# Altium schematic sheet Switch Network.SchDoc
size B; Organization: MASA; SheetNumber: 3; SheetTotal: 7
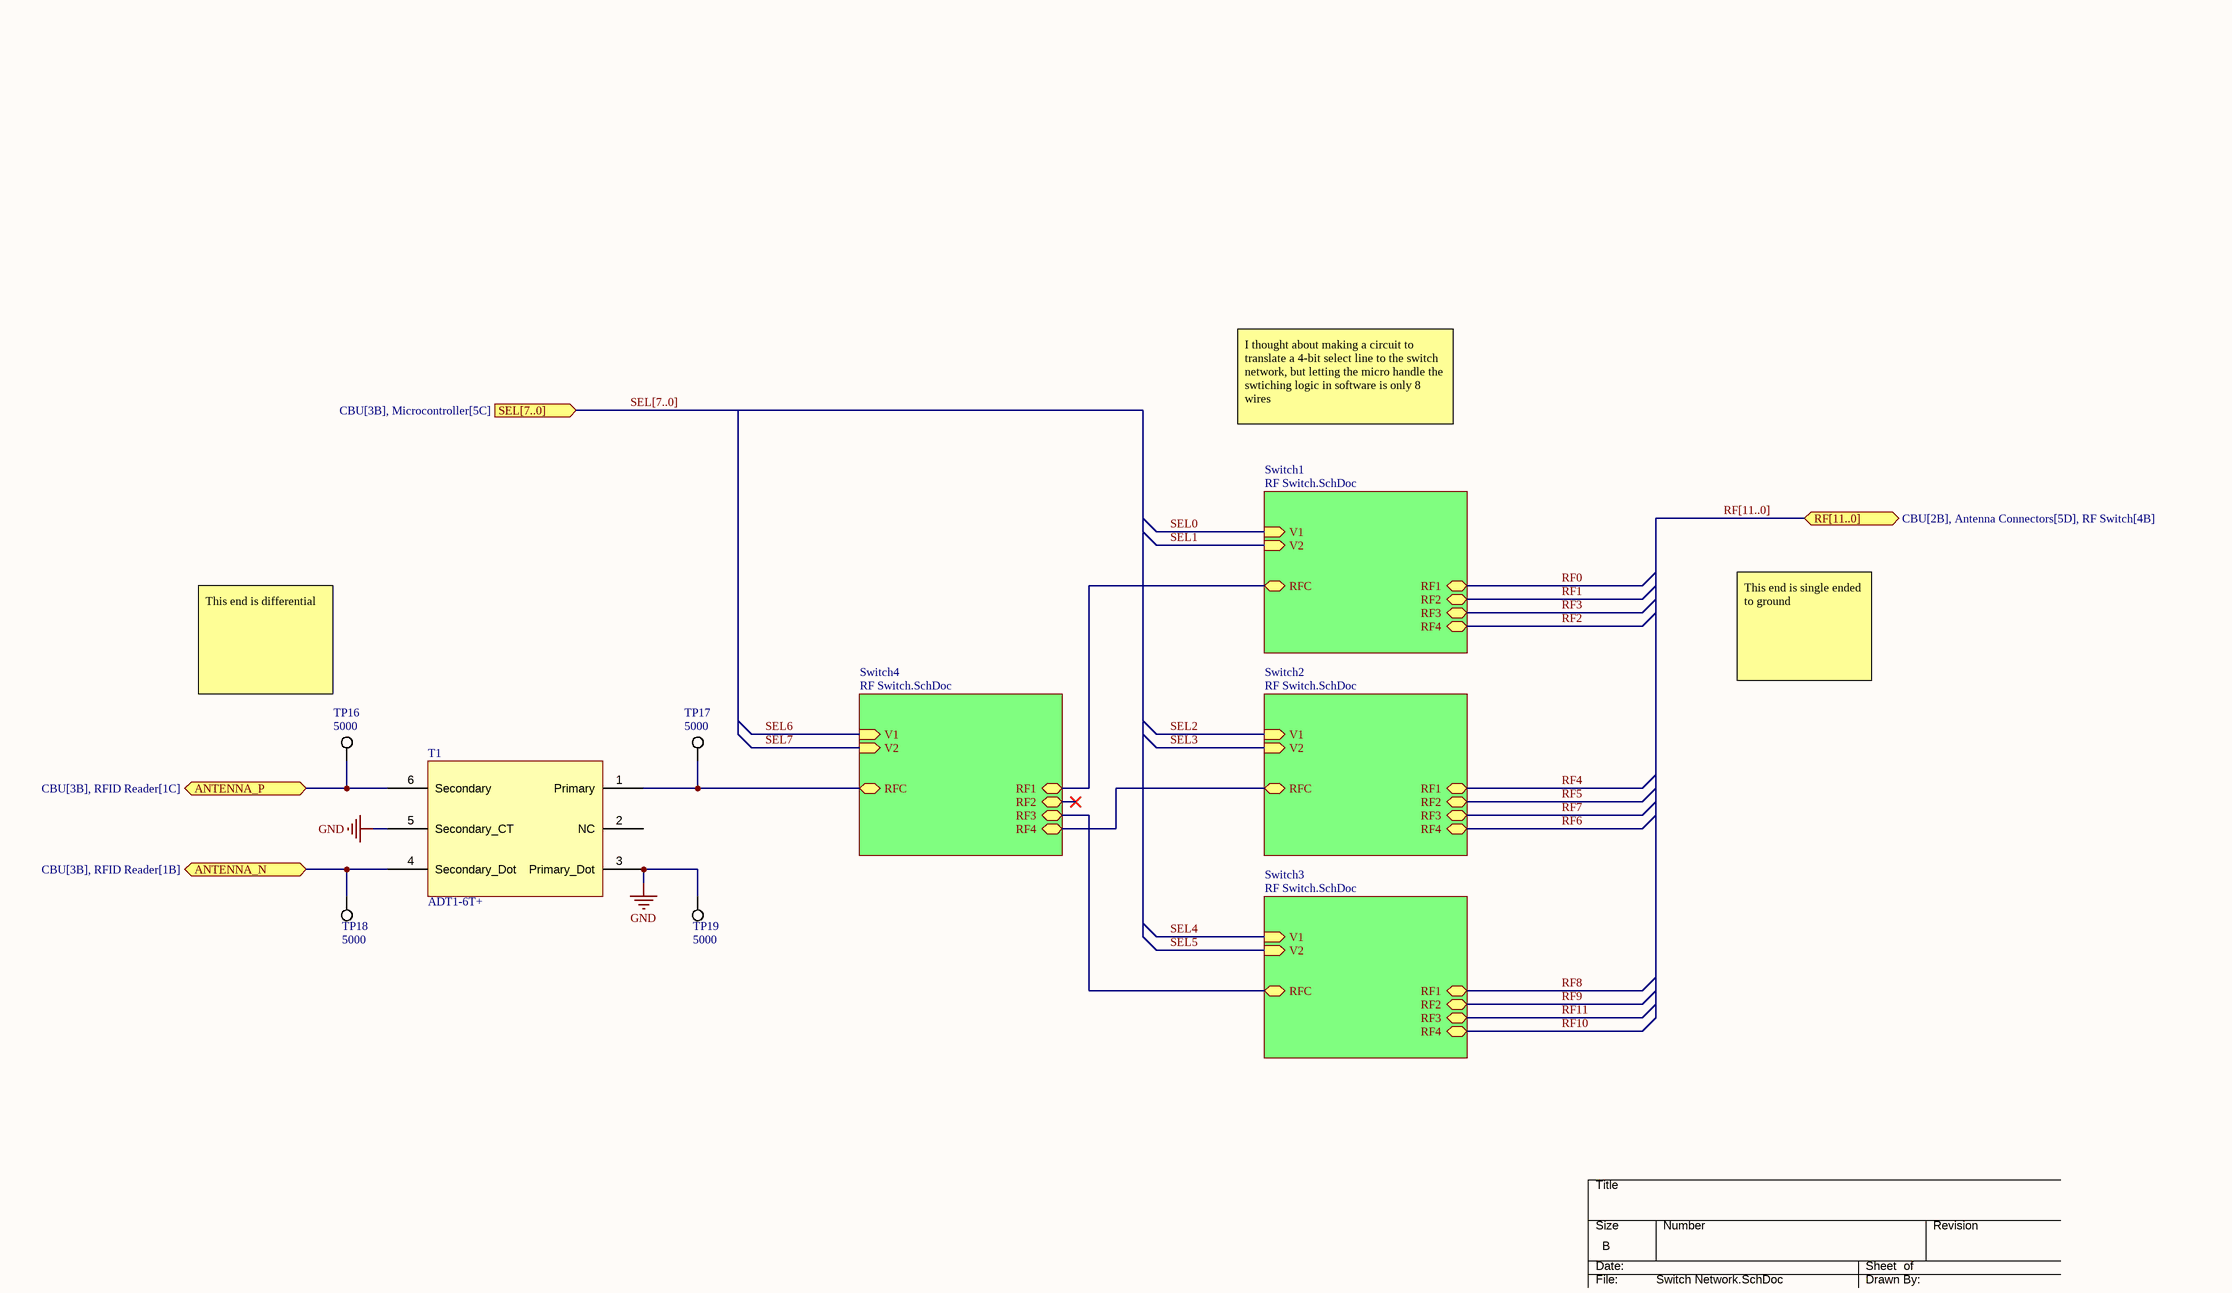
[diagram p0: Switch Network.SchDoc]

## Parts
T1  ADT1-6T+  [ADT1-6T+]
TP16  5000  [FP-5000-MFG]
TP17  5000  [FP-5000-MFG]
TP18  5000  [FP-5000-MFG]
TP19  5000  [FP-5000-MFG]

## Sub-sheets
Switch1 = RF Switch.SchDoc: V1 (in), V2 (in), RF1 (bidir), RF2 (bidir), RF3 (bidir), RF4 (bidir), RFC (bidir)
Switch2 = RF Switch.SchDoc: V1 (in), V2 (in), RF1 (bidir), RF2 (bidir), RF3 (bidir), RF4 (bidir), RFC (bidir)
Switch3 = RF Switch.SchDoc: V1 (in), V2 (in), RF1 (bidir), RF2 (bidir), RF3 (bidir), RF4 (bidir), RFC (bidir)
Switch4 = RF Switch.SchDoc: V1 (in), V2 (in), RF1 (bidir), RF2 (bidir), RF3 (bidir), RF4 (bidir), RFC (bidir)

## Ports
ANTENNA_N (bidir, see CBU[3B], RFID Reader[1B]), ANTENNA_P (bidir, see CBU[3B], RFID Reader[1C]), RF[11..0] (bidir, see CBU[2B], Antenna Connectors[5D], RF Switch[4B]), SEL[7..0] (in, see CBU[3B], Microcontroller[5C])

## Nets
GND: T1.3(Primary_Dot) T1.5(Secondary_CT) TP19.1
ANTENNA_N: T1.4(Secondary_Dot) TP18.1 ; port ANTENNA_N
ANTENNA_P: T1.6(Secondary) TP16.1 ; port ANTENNA_P
RF0: sheet Switch1/RF1
RF1: sheet Switch1/RF2
RF2: sheet Switch1/RF4
RF3: sheet Switch1/RF3
RF4: sheet Switch2/RF1
RF5: sheet Switch2/RF2
RF6: sheet Switch2/RF4
RF7: sheet Switch2/RF3
RF8: sheet Switch3/RF1
RF9: sheet Switch3/RF2
RF10: sheet Switch3/RF4
RF11: sheet Switch3/RF3
SEL0: sheet Switch1/V1
SEL1: sheet Switch1/V2
SEL2: sheet Switch2/V1
SEL3: sheet Switch2/V2
SEL4: sheet Switch3/V1
SEL5: sheet Switch3/V2
SEL6: sheet Switch4/V1
SEL7: sheet Switch4/V2
NetT1_1: T1.1(Primary) TP17.1 ; sheet Switch4/RFC
(unnamed): sheet Switch1/RFC, sheet Switch4/RF1
(unnamed): sheet Switch2/RFC, sheet Switch4/RF4
(unnamed): sheet Switch3/RFC, sheet Switch4/RF3

Not connected (* = marked no-connect by the designer): T1 2(NC)

## Buses and harness runs
bus RF[11..0] = port RF[11..0]
bus SEL[7..0] = port SEL[7..0]

## Notes on the sheet
- I thought about making a circuit to translate a 4-bit select line to the switch network, but letting the micro handle the swtiching logic in software is only 8 wires
- This end is differential
- This end is single ended to ground
- DWG. NO.
- REV.
- SHT.
- THIS DOCUMENT AND THE DATA DISCLOSED HEREIN OR HEREWITH IS THE PROPERTY OF ALTIUM LIMITED AND MAY BE FREELY DISTRIBUTED IN WHOLE. NO RIGHTS ARE RESERVED OR EXPRESS OR IMPLIED WARANTEE GIVEN.
- REVISION
- DESCRIPTION
- DATE
- APPROVED
- ENG:
- APPROVALS
- PROJECT
- DSN:
- CHK:
- REFERENCE DOCUMENTS
- PROJECT REVISION:
- TITLE
- DOCUMENT REVISION:
- DESIGN ITEM:
- BOM:
- FAB DWG:
- PCB DWG:
- ASSY DWG:
- SCALE:
- SIZE
- B
- CAGE CODE
- FILE NAME
- DWG NO.
- SHEET
- OF
- REV

## Library data of the parts
T1 = ADT1-6T+: RF Balun 30kHz ~ 125MHz 50 / 50Ohm 6-SMD, Flat Leads; Supplier 1: Digi-Key; Supplier Part Number 1: 3157-ADT1-6T+CT-ND
TP16-TP19 = 5000: Red PC Test Point, Miniature Phosphor Bronze Silver Plating Through Hole Mounting Type; Connector Type: Interconnection Device; Contact Finish - Termination: Silver (Ag); Reach SVHC Compliant: Yes; JESD-609 Code: e4; RoHS Compliant: Yes; Pins: 1; Mounting Technology: THT; Supplier 1: Future Electronics; Supplier Part Number 1: 8000564